# Altium schematic sheet main.SchDoc
size A4; SheetNumber: 1; SheetTotal: 1; Size: A4; Contact: datasystem.pl
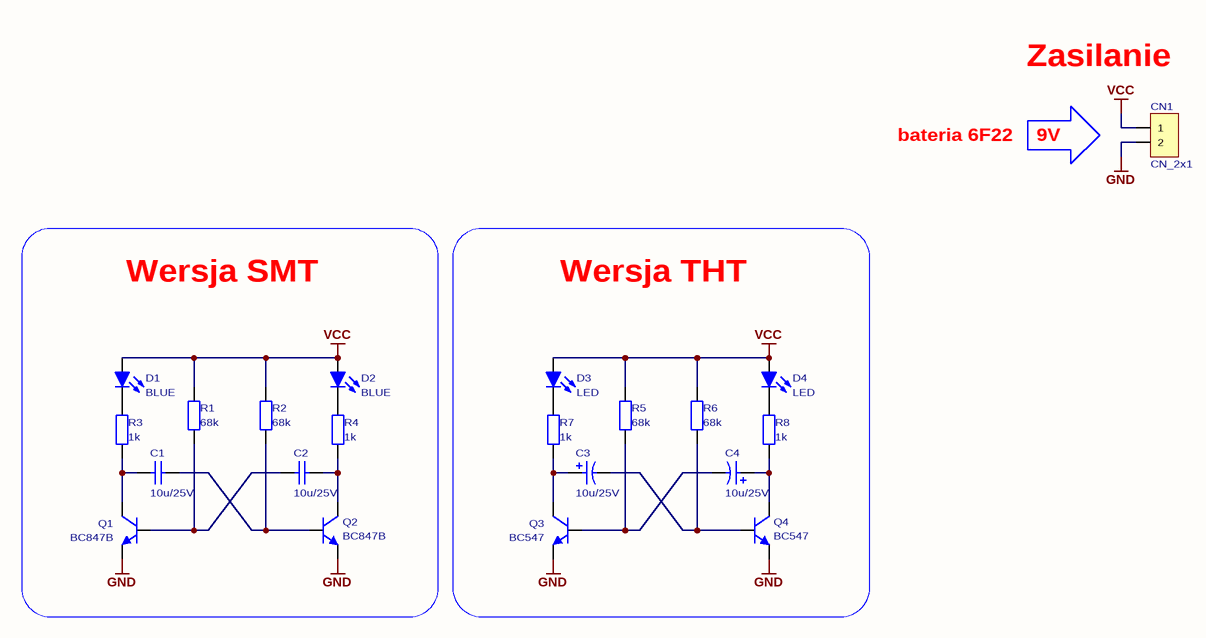
[diagram p0: main.SchDoc]

## Parts
C1  10u/25V  [C1206]
C2  10u/25V  [C1206]
C3  10u/25V  [CE5x11-2]
C4  10u/25V  [CE5x11-2]
CN1  CN_2x1  [GP_2x1]
D1  BLUE  [LED1206B]
D2  BLUE  [LED1206B]
D3  LED  [LED-Polarized]
D4  LED  [LED-Polarized]
Q1  BC847B  [SOT-23]
Q2  BC847B  [SOT-23]
Q3  BC547  [TO-92A]
Q4  BC547  [TO-92A]
R1  68k  [R1206]
R2  68k  [R1206]
R3  1k  [R1206]
R4  1k  [R1206]
R5  68k  [RES10.35-6.8X2.8]
R6  68k  [RES10.35-6.8X2.8]
R7  1k  [RES10.35-6.8X2.8]
R8  1k  [RES10.35-6.8X2.8]

## Blocks framed on the sheet
Wersja SMT: C1 C2 D1 D2 Q1 Q2 R1-R4
Wersja THT: C3 C4 D3 D4 Q3 Q4 R5-R8

## Nets
GND: CN1.2 Q1.2(E) Q2.2(E) Q3.3(E) Q4.3(E)
VCC: CN1.1 D1.1(A) D2.1(A) D3.1(A) D4.1(A) R1.1 R2.1 R5.2 R6.2
NetC1_1: C1.1 Q1.3(C) R3.2
NetC1_2: C1.2 Q2.1(B) R2.2
NetC2_1: C2.1 Q1.1(B) R1.2
NetC2_2: C2.2 Q2.3(C) R4.2
NetC3_1: C3.1 Q3.1(C) R7.1
NetC3_2: C3.2 Q4.2(B) R6.1
NetC4_1: C4.1 Q4.1(C) R8.1
NetC4_2: C4.2 Q3.2(B) R5.1
NetD1_2: D1.2(K) R3.1
NetD2_2: D2.2(K) R4.1
NetD3_2: D3.2(K) R7.2
NetD4_2: D4.2(K) R8.2

## Notes on the sheet
- (near CN1) Zasilanie
- bateria 6F22
- 9V
- A  P  P  R  O  V  E  D
- REV:
- /
- Instytut Elektroniki <http://www.eletel.p.lodz.pl/>
- Katedra Mikroelektroniki i Technik Informatycznych <https://www.dmcs.pl/>
- Katedra Przyrządów Półprzewodnikowych i Optoelektronicznych <http://www.dsod.p.lodz.pl/>
- http://elektronicy.p.lodz.pl
- Project name:
- Title:
- Author:
- Verified by:

## Library data of the parts
C1 C2 = Cap: Capacitor; ComponentLink1Description: datasheet; ComponentLink2Description: supplier; Value: 10u/25V
C3 C4 = Cap Pol: Polarized Capacitor; ComponentLink1Description: datasheet; ComponentLink2Description: supplier; Value: 10u/25V
D1 D2 = LED_BLUE: BLUE LED; Published: 04-Apr-2006
D3 D4 = LED: Typical RED, GREEN, YELLOW, AMBER GaAs LED; Published: 04-Apr-2006
Q1 Q2 = BC847B: NPN General Purpose Transistor (VCE=45V, IC=100mA, HFE=200-450); PowerRating: 250mW; VCEO: 45V; IC: 100mA; HFE: 200-450; Supplier 1: TME; Supplier 2: TME; Supplier 3: TME; Supplier 4: Farnell; Supplier 5: Farnell; Supplier 6: Farnell; Supplier 7: Farnell; Supplier 8: Farnell; Supplier 9: Farnell; Supplier Part Number 1: BC847B.215; Supplier Part Number 2: BC847B-DIO; Supplier Part Number 3: BC847B.235; Supplier Part Number 4: 1562449; Supplier Part Number 5: 1081232; Supplier Part Number 6: 1081232RL; Supplier Part Number 7: 1773608RL; Supplier Part Number 8: 2336781; Supplier Part Number 9: 1574343
Q3 Q4 = BC547: NPN General Purpose Transistor (VCE=45V, IC=100mA); Published: 21-Mar-2006
R1-R8 = Res: Resistor; Published: 19-Feb-2006; ComponentLink1Description: datasheet; ComponentLink2Description: supplier
  R1 R2 R5 R6: Value: 68k
  R3 R4 R7 R8: Value: 1k